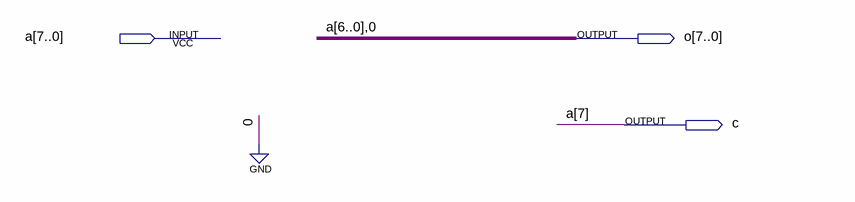
[diagram p0: schematic sheet]
// Quartus schematic LOG_SL8.bdf as structural Verilog: 0 symbols, 3 pins
module LOG_SL8 (
  input  [7:0] a,
  output [7:0] o,
  output c
);


  assign c = a[7];
  assign o = {a[6:0], 1'b0};
endmodule
